# EAGLE design InTNC (EAGLE 6.5.0)
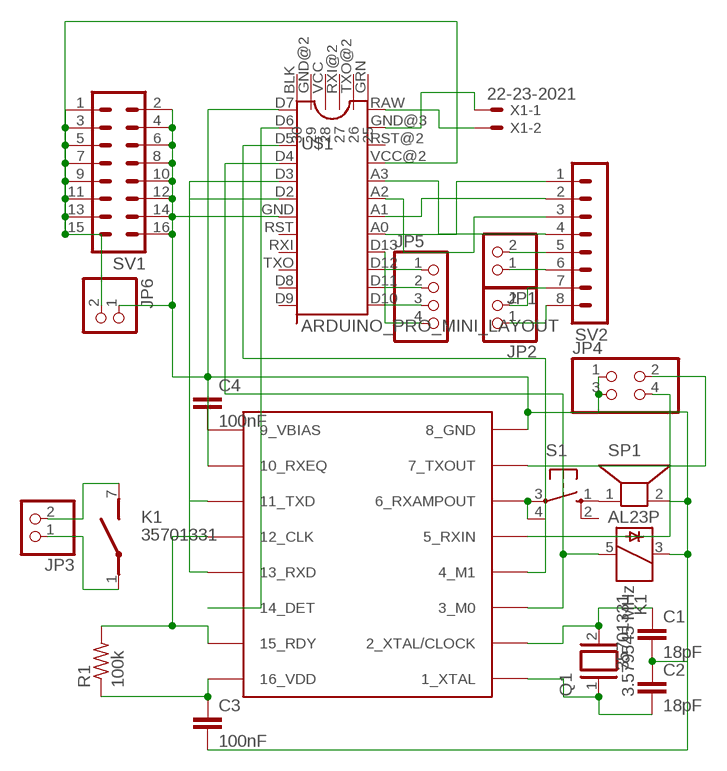
[diagram p0: schematic, sheet 1]

## Parts
C1  18pF  C2.5/2  [C2.5-2]
C2  18pF  C2.5/2  [C2.5-2]
C3  100nF  C2.5/2  [C2.5-2]
C4  100nF  C2.5/2  [C2.5-2]
JP1  PINHD-1X2  [1X02]
JP2  PINHD-1X2  [1X02]
JP3  PINHD-1X2  [1X02]
JP4  PINHD-2X2  [2X02]
JP5  PINHD-1X4  [1X04]
JP6  PINHD-1X2  [1X02]
K1  35701331  [REED]
Q1  3.579545 MHz  XTAL  [Q]
R1  100k  R-US_0204/5  [0204/5]
S1  10-XX  [B3F-10XX]
SP1  AL23P  [AL23P]
SV1  MA08-2  [MA08-2]
SV2  MA08-1  [MA08-1]
U$1  ARDUINO_PRO_MINI_LAYOUT  [ARDUINO_PRO_MINI_PINOUT]
U$2  MX614  [SOIC16-3]
X1  22-23-2021  [22-23-2021]

## Nets
N$1: JP6.2 SV1.1 SV1.3 SV1.5 SV1.7 SV1.9 SV1.11 SV1.13 SV1.15 U$1.VCC@2
N$2: C1.1 Q1.2 U$2.2(2_XTAL/CLOCK)
N$3: C2.2 Q1.1 U$2.1(1_XTAL)
N$4: C1.2 C2.1 C3.2 C4.1 JP4.1 JP4.3 JP6.1 K1.3 SP1.2 SV1.2 SV1.4 SV1.6 SV1.8 SV1.10 SV1.12 SV1.14 SV1.16 U$1.GND U$2.8(8_GND)
N$5: K1.5 U$1.D4 U$2.3(3_M0)
N$6: U$1.D5 U$2.4(4_M1)
N$7: R1.2 U$2.12(12_CLK) U$2.15(15_RDY)
N$8: C3.1 R1.1 U$2.16(16_VDD)
N$9: C4.2 U$2.9(9_VBIAS)
N$10: JP3.2 K1.7(2:S)
N$11: S1.3(P) S1.4(P1) U$2.6(6_RXAMPOUT)
N$12: S1.1(S) SP1.1
N$16: JP3.1 K1.1(2:P)
N$19: JP4.4 U$2.5(5_RXIN)
N$21: JP4.2 U$2.7(7_TXOUT)
N$22: JP5.4 U$1.D10
N$23: SV2.1 U$1.A0
N$24: SV2.2 U$1.A1
N$25: SV2.3 U$1.A2
N$26: SV2.4 U$1.A3
N$27: JP1.2 SV2.5
N$28: JP1.1 SV2.6
N$29: JP2.2 SV2.7
N$30: JP2.1 SV2.8
N$31: U$1.D2 U$2.13(13_RXD)
N$32: U$1.D3 U$2.11(11_TXD)
N$33: JP5.3 U$1.D11
N$34: JP5.2 U$1.D12
N$35: JP5.1 U$1.D13
N$36: U$1.D6 U$2.14(14_DET)
N$37: U$1.D7 U$2.10(10_RXEQ)
N$40: U$1.RAW X1.2
N$41: U$1.GND@3 X1.1
Unconnected: S1.2(S1) U$1.BLK U$1.D8 U$1.D9 U$1.GND@2 U$1.GRN U$1.RST U$1.RST@2 U$1.RXI U$1.RXI@2 U$1.TXO U$1.TXO@2 U$1.VCC

## Library data of the parts
C1-C4 = capacitor-wima:C: CAPACITOR naming: grid - package width
JP1-JP3 JP6 = pinhead:PINHD-1X2: PIN HEADER
JP4 = pinhead:PINHD-2X2: PIN HEADER
JP5 = pinhead:PINHD-1X4: PIN HEADER
K1 = relay:35701331: RELAY reed, 1 x norm. open with polarity; OC_FARNELL: unknown; OC_NEWARK: unknown
Q1 = special:XTAL: CRYSTAL
R1 = rcl:R-US_: RESISTOR, American symbol
S1 = switch-omron:10-XX: OMRON SWITCH; MPN: B3F-1000; OC_FARNELL: 176432; OC_NEWARK: 36M3542
SP1 = buzzer:AL23P: SPEAKER Source: Buerklin; OC_FARNELL: unknown; OC_NEWARK: unknown
SV1 = con-lstb:MA08-2: PIN HEADER; OC_FARNELL: unknown; OC_NEWARK: unknown
SV2 = con-lstb:MA08-1: PIN HEADER; OC_FARNELL: unknown; OC_NEWARK: unknown
U$1 = ArduinoProMini:ARDUINO_PRO_MINI_LAYOUT
U$2 = Ava:MX614
X1 = con-molex:22-23-2021: .100" (2.54mm) Center Header - 2 Pin; MF: MOLEX; MPN: 22-23-2021; OC_FARNELL: 1462926; OC_NEWARK: 25C3832

## Board
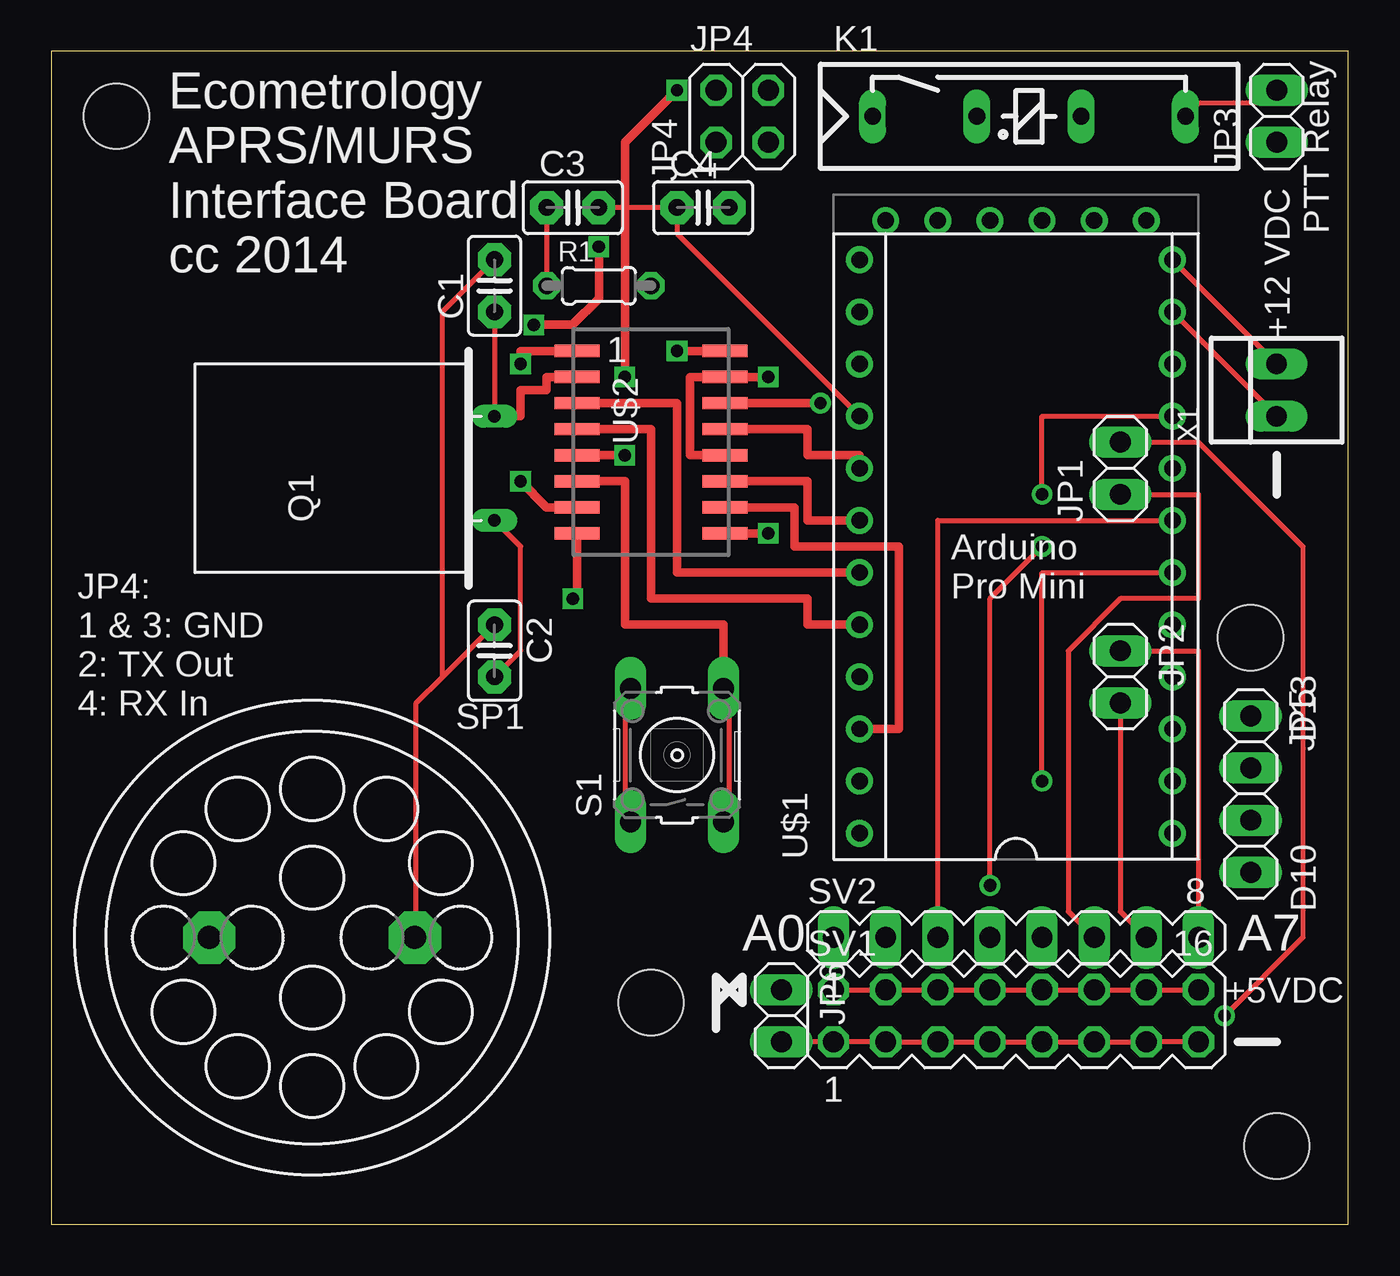
[diagram p1: board, top side]
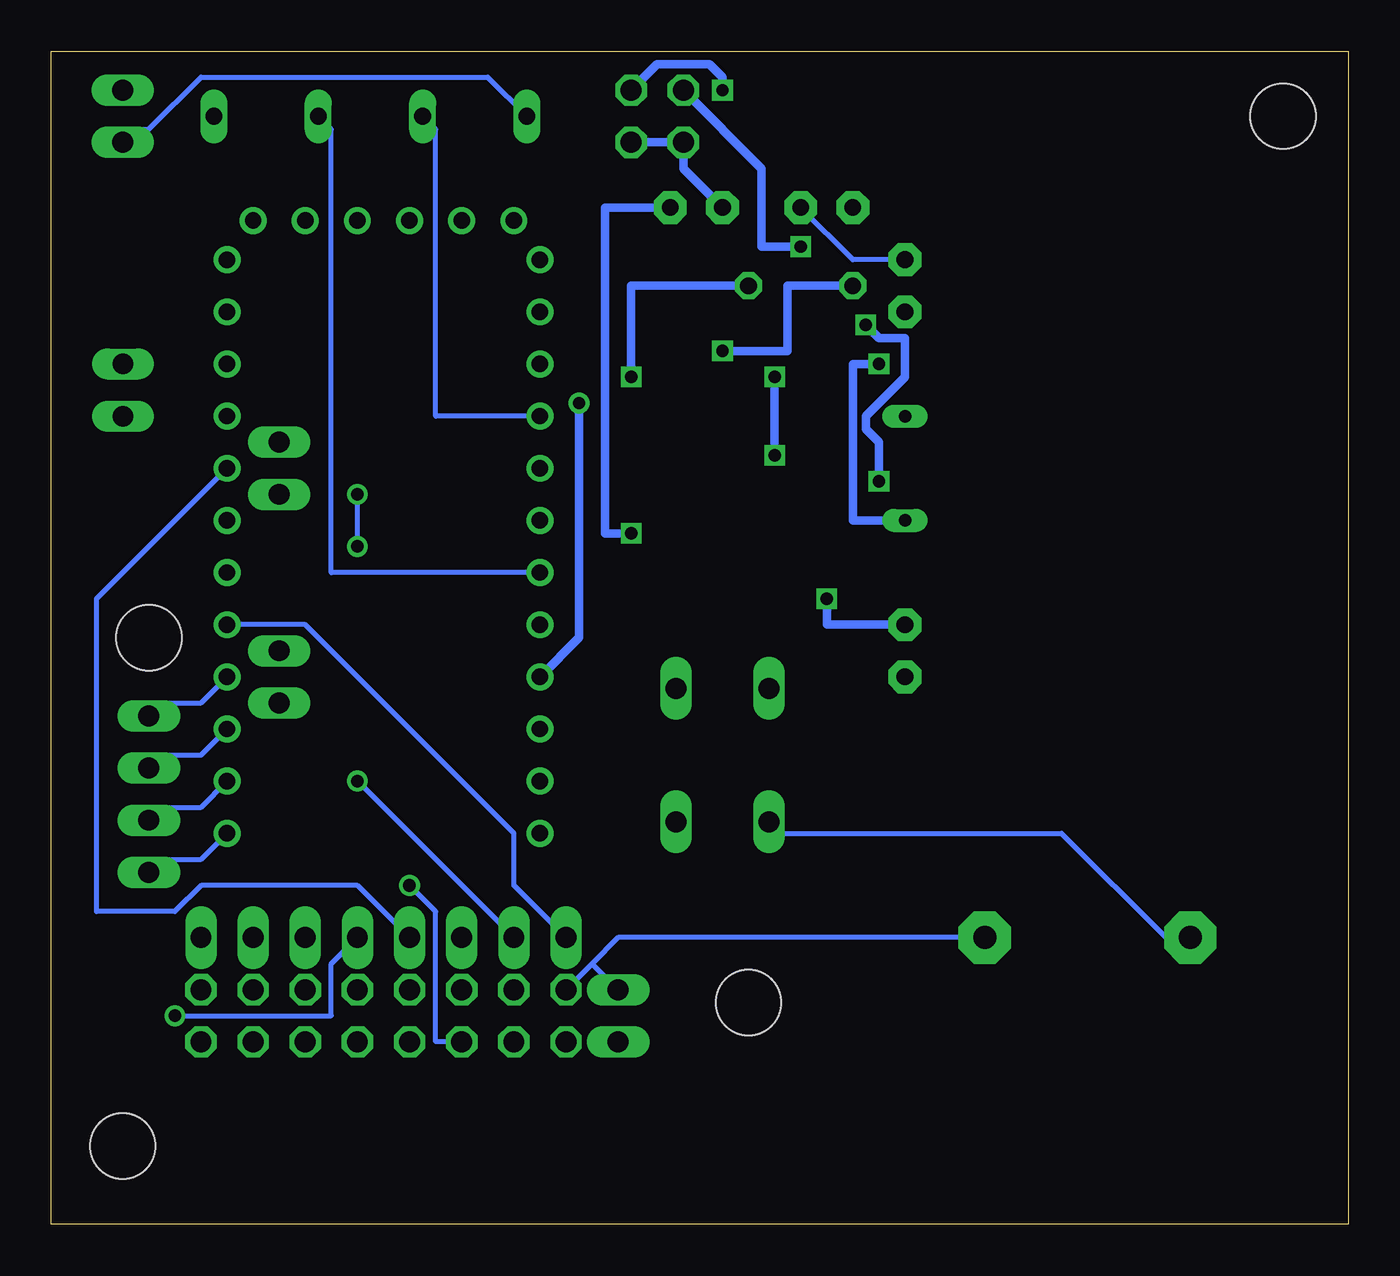
[diagram p2: board, bottom side, seen from below]

Size 63.17 x 57.14 mm. Coordinates in mm from the lower left corner, seen from the top.
Outline: 0,0 63.17,0 63.17,57.14 0,57.14 0,0
Copper layers (1*16): Top 0.035mm / dielectric 1.5mm / Bottom 0.035mm
Design rules "default": minimum track width 10mil, minimum drill 24mil, track to track 8mil, track to pad 8mil, pad to pad 8mil, via to via 8mil, smd to smd 8mil, copper to edge 40mil, drill to drill 8mil, minimum pad ring 10mil, minimum via ring 8mil, stop-mask expansion 4mil, vias tented up to drill 0mil, thermal gap 10mil
Holes 3.17 mm at 3.18,53.98 59.69,3.81 29.21,10.79 58.42,28.57

### Footprints (pad centres in the part's own frame; a part is rotated, then mirrored left to right if it is on the bottom)
C2.5-2 = drill 0.813 pad 1.6 octagon: 1 -1.27,0; 2 1.27,0
1X02 = drill 1.016 long: 1 -1.27,0; 2 1.27,0
2X02 = drill 1.016 octagon: 1 -1.27,-1.27; 2 -1.27,1.27; 3 1.27,-1.27; 4 1.27,1.27
1X04 = drill 1.016 long: 1 -3.81,0; 2 -1.27,0; 3 1.27,0; 4 3.81,0
REED = drill 0.813 long: 1 -17.78,2.54; 3 -12.7,2.54; 5 -7.62,2.54; 7 -2.54,2.54
Q = drill 0.61 long: 1 -2.54,-7.62; 2 2.54,-7.62
0204/5 = drill 0.813 octagon: 1 -2.54,0; 2 2.54,0
B3F-10XX = drill 1.016 long: 1 -3.251,2.261; 2 3.251,2.261; 3 -3.251,-2.261; 4 3.251,-2.261
AL23P = drill 1.118 pad 2.54 octagon: 1 -5.004,0; 2 5.004,0
MA08-2 = drill 1.016 octagon: 1 -8.89,-1.27; 2 -8.89,1.27; 3 -6.35,-1.27; 4 -6.35,1.27; 5 -3.81,-1.27; 6 -3.81,1.27; 7 -1.27,-1.27; 8 -1.27,1.27; 9 1.27,-1.27; 10 1.27,1.27; 11 3.81,-1.27; 12 3.81,1.27; 13 6.35,-1.27; 14 6.35,1.27; 15 8.89,-1.27; 16 8.89,1.27
MA08-1 = drill 1.016 long: 1 -8.89,0; 2 -6.35,0; 3 -3.81,0; 4 -1.27,0; 5 1.27,0; 6 3.81,0; 7 6.35,0; 8 8.89,0
ARDUINO_PRO_MINI_PINOUT = drill 0.8: A0 -3.81,-7.62; A1 -1.27,-7.62; A2 1.27,-7.62; A3 3.81,-7.62; BLK 15.875,6.35; D2 3.81,7.62; D3 1.27,7.62; D4 -1.27,7.62; D5 -3.81,7.62; D6 -6.35,7.62; D7 -8.89,7.62; D8 -11.43,7.62; D9 -13.97,7.62; D10 -13.97,-7.62; D11 -11.43,-7.62; D12 -8.89,-7.62; D13 -6.35,-7.62; GND 6.35,7.62; GND@2 15.875,3.81; GND@3 11.43,-7.62; GRN 15.875,-6.35; RAW 13.97,-7.62; RST 8.89,7.62; RST@2 8.89,-7.62; RXI 11.43,7.62; RXI@2 15.875,-1.27; TXO 13.97,7.62; TXO@2 15.875,-3.81; VCC 15.875,1.27; VCC@2 6.35,-7.62
SOIC16-3 = smd 0.6 x 2.2: 1 -4.445,-3.6; 2 -3.175,-3.6; 3 -1.905,-3.6; 4 -0.635,-3.6; 5 0.635,-3.6; 6 1.905,-3.6; 7 3.175,-3.6; 8 4.445,-3.6; 9 4.445,3.6; 10 3.175,3.6; 11 1.905,3.6; 12 0.635,3.6; 13 -0.635,3.6; 14 -1.905,3.6; 15 -3.175,3.6; 16 -4.445,3.6
22-23-2021 = drill 1 long: 1 -1.27,0; 2 1.27,0

### Placement (x,y rotation side)
C1  21.59,45.72 90 top
C2  21.59,27.94 270 top
C3  25.4,49.53 0 top
C4  31.75,49.53 0 top
JP1  52.07,36.83 90 top
JP2  52.07,26.67 270 top
JP3  59.69,53.98 90 top
JP4  33.66,53.98 0 top
JP5  58.42,20.95 270 top
JP6  35.56,10.16 270 top
K1  57.78,51.44 0 top
Q1  13.97,36.83 90 top
R1  26.67,45.72 0 top
S1  30.48,22.86 90 top
SP1  12.7,13.97 0 top
SV1  46.99,10.16 0 top
SV2  46.99,13.97 0 top
U$1  46.99,33.02 90 top
U$2  29.21,38.1 270 top
X1  59.69,40.64 90 top

### Tracks (layer width: path | path; a pad name or v marks a point on that pad's centre or on a via)
N$1  (via drill 0.61)
  Top 0.254: SV1.15 SV1.13 SV1.11 SV1.9 SV1.7 SV1.5 SV1.3 SV1.1 JP6.2 | U$1.VCC@2 48.26,39.37 v48.26,35.56 | v48.26,33.02 45.72,30.48 v45.72,16.51
  Bottom 0.254: v48.26,33.02 v48.26,35.56 | v45.72,16.51 44.45,15.24 44.45,8.89 SV1.5
N$2
  Top 0.254: C1.1 Q1.2
  Top 0.406: Q1.2 22.86,39.37 22.86,40.64 24.13,40.64 24.13,41.27 U$2.2
N$3  (via drill 0.6)
  Top 0.254: Q1.1 22.86,33.02 22.86,27.94 C2.2
  Top 0.406: U$2.1 22.86,42.55 v22.86,41.91
  Bottom 0.406: v22.86,41.91 24.13,41.91 24.13,34.29 Q1.1
N$4  (via drill 0.6)
  Top 0.254: SV1.2 SV1.4 SV1.6 SV1.8 SV1.10 SV1.12 SV1.14 SV1.16 | C3.2 C4.1 30.48,48.26 U$1.GND | 19.05,26.67 17.78,25.4 17.78,13.97 SP1.2 | 19.05,26.67 C2.1 | C1.2 19.05,44.45 19.05,26.67
  Top 0.406: v25.4,30.48 25.61,30.48 U$2.8
  Bottom 0.254: 36.83,12.7 35.56,13.97 SP1.2 | 36.83,12.7 SV1.2 | C3.2 24.13,46.99 C1.2 | U$1.GND 44.45,39.37 44.45,53.34 K1.3 | 36.83,12.7 JP6.1
  Bottom 0.406: C2.1 25.4,29.21 v25.4,30.48 | C4.1 32.39,51.44 JP4.1 JP4.3
N$5
  Top 0.406: U$2.3 30.48,40.01 30.48,31.75 U$1.D4
  Bottom 0.254: U$1.D4 49.53,31.75 49.53,53.34 K1.5
N$6
  Top 0.406: U$2.4 29.21,38.73 29.21,30.48 36.83,30.48 36.83,29.21 U$1.D5
N$7  (via drill 0.6)
  Top 0.406: v34.92,41.27 U$2.15 31.11,41.27 31.11,37.47 U$2.12
  Bottom 0.406: R1.2 34.92,45.72 v34.92,41.27
N$8  (via drill 0.6)
  Top 0.254: C3.1 R1.1
  Top 0.406: v30.48,42.55 U$2.16
  Bottom 0.406: R1.1 27.31,45.72 27.31,42.55 v30.48,42.55
N$9  (via drill 0.6)
  Top 0.406: U$2.9 v34.92,33.66
  Bottom 0.406: v34.92,33.66 36.2,33.66 36.2,49.53 C4.2
N$10
  Top 0.254: K1.7 55.88,54.61 59.69,54.61 JP3.2
N$11
  Top 0.254: S1.3 33.02,20.32 33.02,25.4 S1.4
  Top 0.406: U$2.6 27.94,36.2 27.94,29.21 32.74,29.21 S1.4
N$12
  Top 0.254: 27.94,25.4 27.94,20.32 S1.1
  Bottom 0.254: SP1.1 8.89,13.97 13.97,19.05 27.94,19.05 S1.1
N$13  (via drill 0.6)
  other vias: 30.48,42.55
N$14  (via drill 0.6)
  other vias: 34.92,41.27
N$15  (via drill 0.6)
  other vias: 34.92,33.66
N$16
  Bottom 0.254: K1.1 41.91,55.88 55.88,55.88 58.42,53.34 59.69,53.34 JP3.1
N$17  (via drill 0.6)
  other vias: 27.94,37.47
N$18  (via drill 0.6)
  other vias: 27.94,41.27
N$19  (via drill 0.6)
  Top 0.406: U$2.5 v27.94,37.47 | v27.94,41.27 27.94,52.7 v30.48,55.24
  Bottom 0.406: v27.94,37.47 v27.94,41.27 | v30.48,55.24 30.48,55.88 31.11,56.52 33.66,56.52 JP4.4
N$20  (via drill 0.6)
  other vias: 22.86,36.2
N$21  (via drill 0.6)
  Top 0.406: U$2.7 24.13,34.92 v22.86,36.2 | v23.5,43.81 25.4,43.81 26.67,45.09 v26.67,47.62
  Bottom 0.406: v22.86,36.2 22.86,38.1 23.5,38.73 23.5,39.37 21.59,41.27 21.59,43.18 22.86,43.18 v23.5,43.81 | v26.67,47.62 28.58,47.62 28.58,51.44 JP4.2
N$22
  Bottom 0.254: U$1.D10 55.88,17.78 58.42,17.78 JP5.4
N$23
  Bottom 0.254: U$1.A0 50.8,29.21 40.64,19.05 40.64,16.51 SV2.1
N$24  (via drill 0.61)
  Top 0.254: U$1.A1 48.26,31.75 v48.26,21.59
  Bottom 0.254: SV2.2 v48.26,21.59
N$25
  Top 0.254: U$1.A2 43.18,34.29 SV2.3
N$26
  Bottom 0.254: U$1.A3 60.96,30.48 60.96,15.24 57.15,15.24 55.88,16.51 48.26,16.51 SV2.4
N$27  (via drill 0.61)
  Top 0.254: v57.15,10.16 60.96,13.97 60.96,33.02 55.88,38.1 JP1.2
  Bottom 0.254: SV2.5 49.53,12.7 49.53,10.16 v57.15,10.16
N$28
  Top 0.254: SV2.6 49.53,15.24 49.53,27.94 52.07,30.48 55.88,30.48 55.88,35.56 JP1.1
N$29
  Top 0.254: SV2.7 52.07,15.24 JP2.2
N$30
  Top 0.254: SV2.8 55.88,27.94 JP2.1
N$31
  Top 0.406: U$2.13 36.83,38.73 36.83,37.47 39.37,37.47 U$1.D2
N$32
  Top 0.406: U$2.11 36.83,36.2 36.83,34.29 U$1.D3
N$33
  Bottom 0.254: U$1.D11 55.88,20.32 58.42,20.32 JP5.3
N$34
  Bottom 0.254: U$1.D12 55.88,22.86 58.42,22.86 JP5.2
N$35
  Bottom 0.254: U$1.D13 55.88,25.4 58.42,25.4 JP5.1
N$36  (via drill 0.6)
  Top 0.406: v37.47,40.01 U$2.14
  Bottom 0.406: U$1.D6 37.47,28.57 v37.47,40.01
N$37
  Top 0.406: U$2.10 36.2,34.92 36.2,33.02 41.28,33.02 41.28,24.13 U$1.D7
N$40
  Top 0.254: X1.2 U$1.RAW
N$41
  Top 0.254: X1.1 U$1.GND@3

### Text on the board
tPlace: JP4 / 1 | PTT Relay | Ecometrology / APRS/MURS / Interface Board / cc 2014 | +12 VDC | Arduino / Pro Mini | JP4: / 1 & 3: GND / 2: TX Out / 4: RX In | D13 | D10 | A0 | A7 | +5VDC